# EAGLE design complete system Rev A (EAGLE 7.3.0)
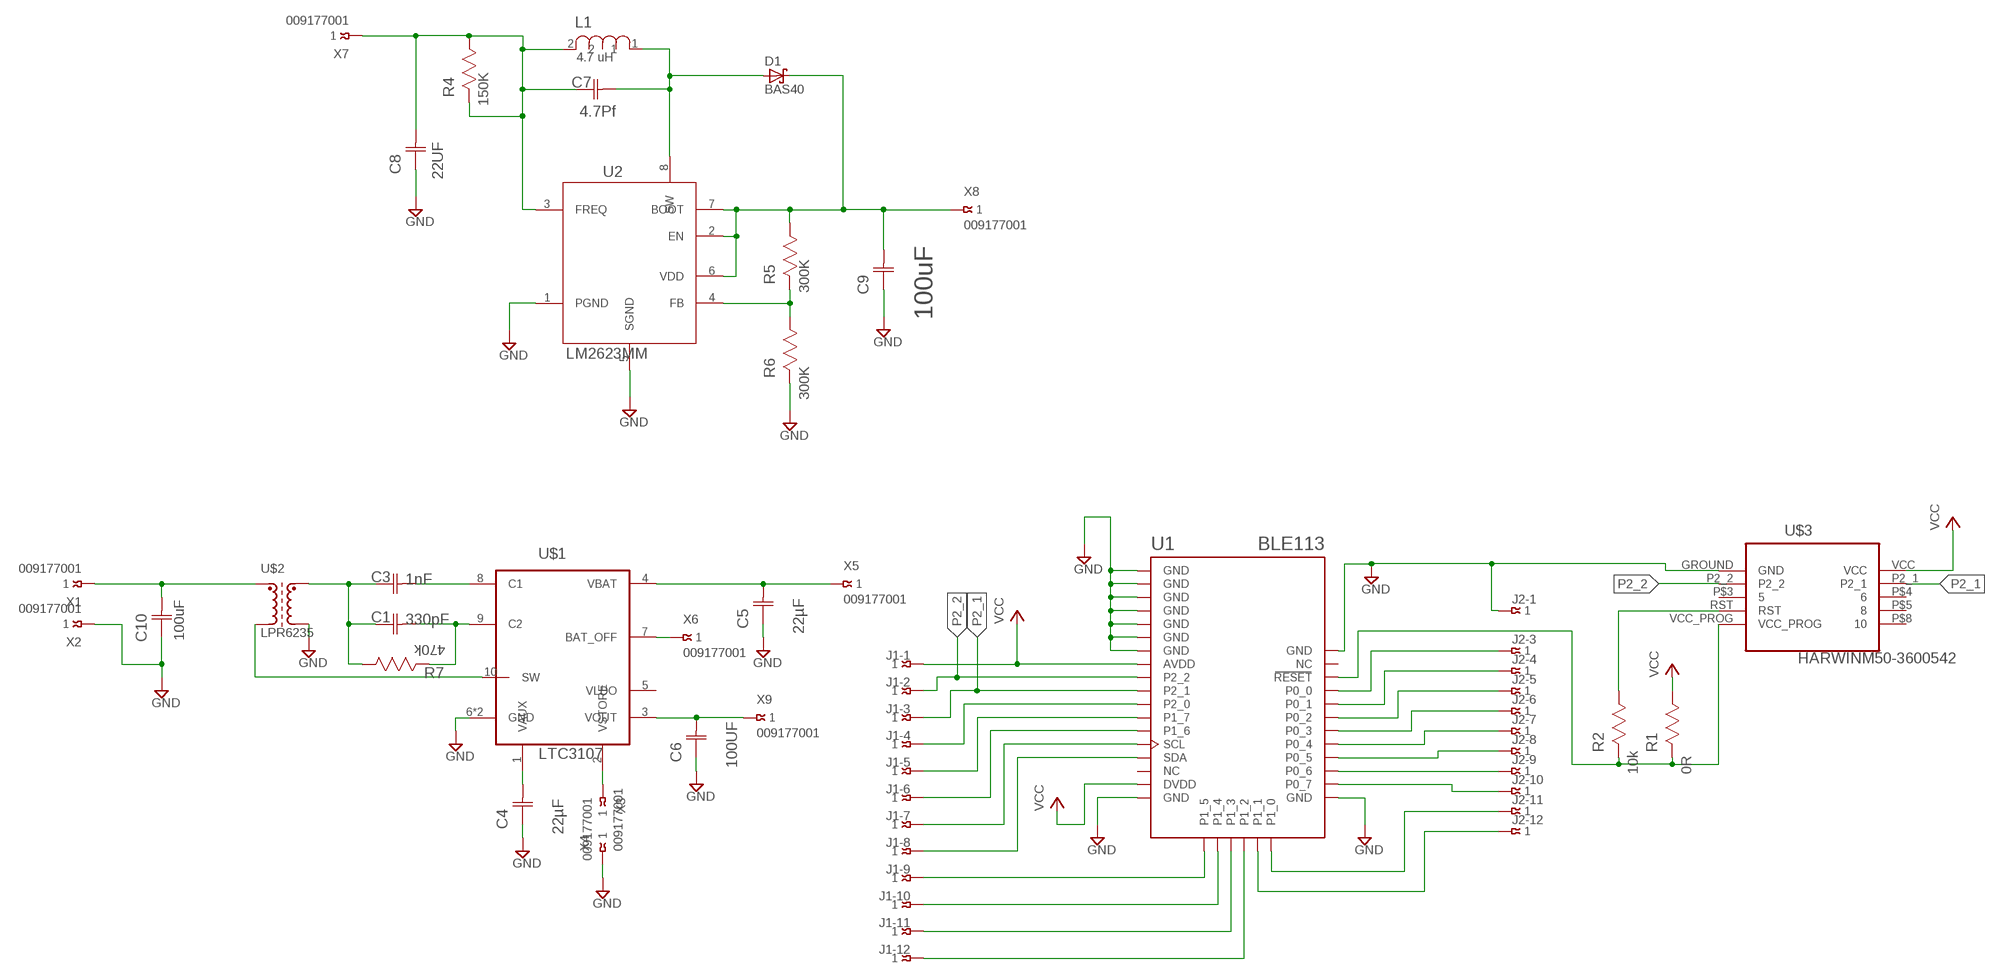
[diagram p0: schematic, sheet 1]

## Parts
C1  330pF  0402YD105KAT2A  [CAPC1005X60N]
C3  1nF  0402YD105KAT2A  [CAPC1005X60N]
C4  22µF  TCJA156M006R0300  [CAPCP3216X180N]
C5  22µF  TCJA156M006R0300  [CAPCP3216X180N]
C6  100UF  TACA107M006XTA  [CAPCP3216X180N]
C7  4.7Pf  0402YD105KAT2A  [CAPC1005X60N]
C8  22UF  0805YA120KAT2A  [CAPC2012X94N]
C9  100uF  C1206C107M9PACTU  [CAPC3216X180N]
C10  100uF  C1206C107M9PACTU  [CAPC3216X180N]
D1  BAS40  [SOT23]
J1-1  009177001  [009177001]
J1-2  009177001  [009177001]
J1-3  009177001  [009177001]
J1-4  009177001  [009177001]
J1-5  009177001  [009177001]
J1-6  009177001  [009177001]
J1-7  009177001  [009177001]
J1-8  009177001  [009177001]
J1-9  009177001  [009177001]
J1-10  009177001  [009177001]
J1-11  009177001  [009177001]
J1-12  009177001  [009177001]
J2-1  009177001  [009177001]
J2-3  009177001  [009177001]
J2-4  009177001  [009177001]
J2-5  009177001  [009177001]
J2-6  009177001  [009177001]
J2-7  009177001  [009177001]
J2-8  009177001  [009177001]
J2-9  009177001  [009177001]
J2-10  009177001  [009177001]
J2-11  009177001  [009177001]
J2-12  009177001  [009177001]
L1  4.7 uH  PM1210-4R7J-RC  [INDC3225X22N]
R1  0R  CRCW0402300KFKED  [RESC1005X40N]
R2  10k  CRCW0402300KFKED  [RESC1005X40N]
R4  150K  CRCW0402150KFKED  [RESC1005X40N]
R5  300K  CRCW0402300KFKED  [RESC1005X40N]
R6  300K  CRCW0402300KFKED  [RESC1005X40N]
R7  470k  CRCW0402300KFKED  [RESC1005X40N]
U1  BLE113  BLE113-VISUAL-A  [BLE113-A]
U2  LM2623MM  [SOP65P490X110-8N]
U$1  LTC3107  [LTC3107]
U$2  LPR6235  [LPR6235]
U$3  HARWINM50-3600542  [HARWINM50-3600542]
X1  009177001  [009177001]
X2  009177001  [009177001]
X3  009177001  [009177001]
X4  009177001  [009177001]
X5  009177001  [009177001]
X6  009177001  [009177001]
X7  009177001  [009177001]
X8  009177001  [009177001]
X9  009177001  [009177001]

## Nets
GND: C4.1(C1) C5.1(C1) C6.1(C1) C8.1(C1) C9.1(C1) C10.1(C1) J2-1.1 R6.2 U1.GND U1.GND@2(GND) U1.GND@3(GND) U1.GND@4(GND) U1.GND@5(GND) U1.GND@6(GND) U1.GND@7(GND) U1.GND@8(GND) U1.GND@9(GND) U1.GND@10(GND) U2.1(PGND) U2.5(SGND) U$1.6(GND) U$1.11(GND) U$2.P$3(OP2) U$3.GROUND(GND) X2.1 X4.1
LL: J2-11.1 U1.P1_0
N$1: C10.2(C2) U$2.P$1(IP1) X1.1
N$2: U$1.10(SW) U$2.P$2(IP2)
N$3: C1.1(C2) R7.2 U$1.9(C2)
N$4: C1.2(C1) C3.2(C1) R7.1 U$2.P$4(OP1)
N$5: C3.1(C2) U$1.8(C1)
N$6: C4.2(C2) U$1.1(VAUX)
N$7: U$1.2(VSTORE) X3.1
N$8: C5.2(C2) U$1.4(VBAT) X5.1
N$9: U$1.7(BAT_OFF) X6.1
N$10: C6.2(C2) U$1.3(VOUT) X9.1
N$12: R2.1 U$3.RST
N$13: J1-4.1 U1.P2_0
N$14: J1-5.1 U1.P1_7
N$15: J1-6.1 U1.P1_6
N$16: J1-7.1 U1.SCL
N$17: J1-8.1 U1.SDA
N$18: J1-9.1 U1.P1_5
N$19: J1-10.1 U1.P1_4
N$20: J1-11.1 U1.P1_3
N$21: J1-12.1 U1.P1_2
N$22: J2-3.1 U1.P0_0
N$23: J2-4.1 U1.P0_1
N$24: R1.2 R2.2 U1.RESET U$3.VCC_PROG
N$25: J2-5.1 U1.P0_2
N$26: J2-6.1 U1.P0_3
N$27: J2-7.1 U1.P0_4
N$28: J2-8.1 U1.P0_5
N$29: J2-9.1 U1.P0_6
N$30: J2-10.1 U1.P0_7
N$31: C7.1(C2) D1.1(A) L1.1 U2.8(SW)
N$32: J2-12.1 U1.P1_1
N$33: C7.2(C1) C8.2(C2) L1.2 R4.1 R4.2 U2.3(FREQ) X7.1
N$35: C9.2(C2) D1.3(C) R5.1 U2.2(EN) U2.6(VDD) U2.7(BOOT) X8.1
N$36: R5.2 R6.1 U2.4(FB)
P2_1: J1-3.1 U1.P2_1 U$3.P2_1
P2_2: J1-2.1 U1.P2_2 U$3.P2_2
VCC: J1-1.1 R1.1 U1.AVDD U1.DVDD U$3.VCC
Unconnected: U1.NC U1.NC@2(NC) U$1.5(VLDO) U$3.P$3 U$3.P$4 U$3.P$5 U$3.P$8

## Library data of the parts
C1 C3 C7 = AVX_By_element14_Batch_1:0402YD105KAT2A: Capacitor 0402; MPN: 0402YD105KAT2A; OC_FARNELL: 1867953; OC_NEWARK: 37T9045; SUPPLIER: AVX; TOLERANCE: ±10%; VALUE: 1uF; VOLTAGERATING: 16V
C4 C5 = AVX_By_element14_Batch_1:TCJA156M006R0300: Tantalum Capacitor , 1206; CAPACITANCETOLERANCE: ±20%; MPN: TCJA156M006R0300; OC_FARNELL: 1546774; OC_NEWARK: 59M9561; SUPPLIER: AVX; VALUE: 15µF; VOLTAGERATING: 6.3V
C6 = AVX_By_element14_Batch_1:TACA107M006XTA: Tantalum Capacitor , 1206; CAPACITANCETOLERANCE: ±20%; MPN: TACA107M006XTA; OC_FARNELL: -; OC_NEWARK: 10R5817; SUPPLIER: AVX; VOLTAGERATING: 6.3V
C8 = AVX_By_element14_Batch_1:0805YA120KAT2A: Capacitor 0805; MPN: 0805YA120KAT2A; OC_FARNELL: -; OC_NEWARK: 55J5412; SUPPLIER: AVX; TOLERANCE: ±10%; VALUE: 12PF; VOLTAGERATING: 16V
C9 C10 = Kemet_By_element14_Batch_1:C1206C107M9PACTU: CAPACITOR, 1206; MPN: C1206C107M9PACTU; OC_FARNELL: 1358552; OC_NEWARK: 94M5669; SUPPLIER: Kemet; TOLERANCE: ±20%; VOLTAGERATING: 6.3V
D1 = diode:BAS40: Silicon Schottky Diodes General-purpose diode for high-speed switching
J1-1-J1-12 J2-1 J2-3-J2-12 X1-X9 = con-avx:00917?001: Wire to Board Strip IDC Connector 1 WAY Source: http://www.avx.com/docs/Catalogs/9177.pdf; MPN: 009177001001006; OC_FARNELL: unknown; OC_NEWARK: 09P1120
L1 = Bourns_By_element14_Batch_1:PM1210-4R7J-RC: CHIP INDUCTOR, 4.7UH 220MA 5% 50MHZ; MPN: PM1210-4R7J-RC; OC_FARNELL: 1180481; OC_NEWARK: 63K3111; SUPPLIER: BOURNS; TOLERANCE: ±5 %; VALUE: 2.2 uH
R1 R2 R5-R7 = Vishay_By_element14_Batch_1:CRCW0402300KFKED: RESISTOR, 0402; MPN: CRCW0402300KFKED; OC_FARNELL: 1563590; OC_NEWARK: 72M6774; SUPPLIER: VISHAY DALE ELECTRONICS; TOLERANCE: ±1%; VALUE: 300K Ohms; WATTAGE: 0.063 W
R4 = Vishay_By_element14_Batch_1:CRCW0402150KFKED: RESISTOR, 0402; MPN: CRCW0402150KFKED; OC_FARNELL: 1652753; OC_NEWARK: 52K6719; SUPPLIER: Vishay; TOLERANCE: ±1%; VALUE: 150K Ohms; WATTAGE: 0.063W
U1 = bluegiga:BLE113-VISUAL: Bluetooth Low Energy single-mode module - Bluetooth 4.0 (CC2541). BLE113-A variant has an on-module ceramic chip antenna. BLE113-A variant includes keepout/restrict area. Antenna edge of the module should be flush up against the edge of the PCB. See datasheet for variant layout details. The BLE113 is a Bluetooth Smart module targeted for small and low-power sensors and accessories. It integrates all features required for a Bluetooth Smart application, including Bluetooth radio, software stack, and GATT-based profiles. The BLE113 Bluetooth Smart module can also host end-user applications, which means no external micro controller is required in size or price constrained devices. Moreover, it has flexible hardware interfaces to connect to different peripherals and sensors and can be powered directly from a standard 3V coin cell battery or a pair of AAA batteries. In the lowest power sleep mode it merely consumes 500 nA and will wake up within a few hundred microseconds. The BLE113 Bluetooth Smart module conusmer approximately 30% less power and is smaller than the BLE112 Bluetooth Smart Module. http://www.bluegiga.com/en-US/products/bluetooth-4.0-modules/ble113-bluetooth--smart-module https://github.com/jrowberg/sf-oshw Last updated 2014-01-04 by Jeff Rowberg <jeff@rowberg.net>; ANTENNA: On-module ceramic chip antenna
U2 = NSC_By_element14_Batch_1.1:LM2623MM: DC/DC Boost Converter; MPN: LM2623MM; OC_FARNELL: 8207453; OC_NEWARK: 41K3962; PACKAGE: 8-MSOP; SUPPLIER: National Semiconductors
U$1 = Nathan:LTC3107
U$2 = Nathan:LPR6235
U$3 = Nathan:HARWINM50-3600542

## Board
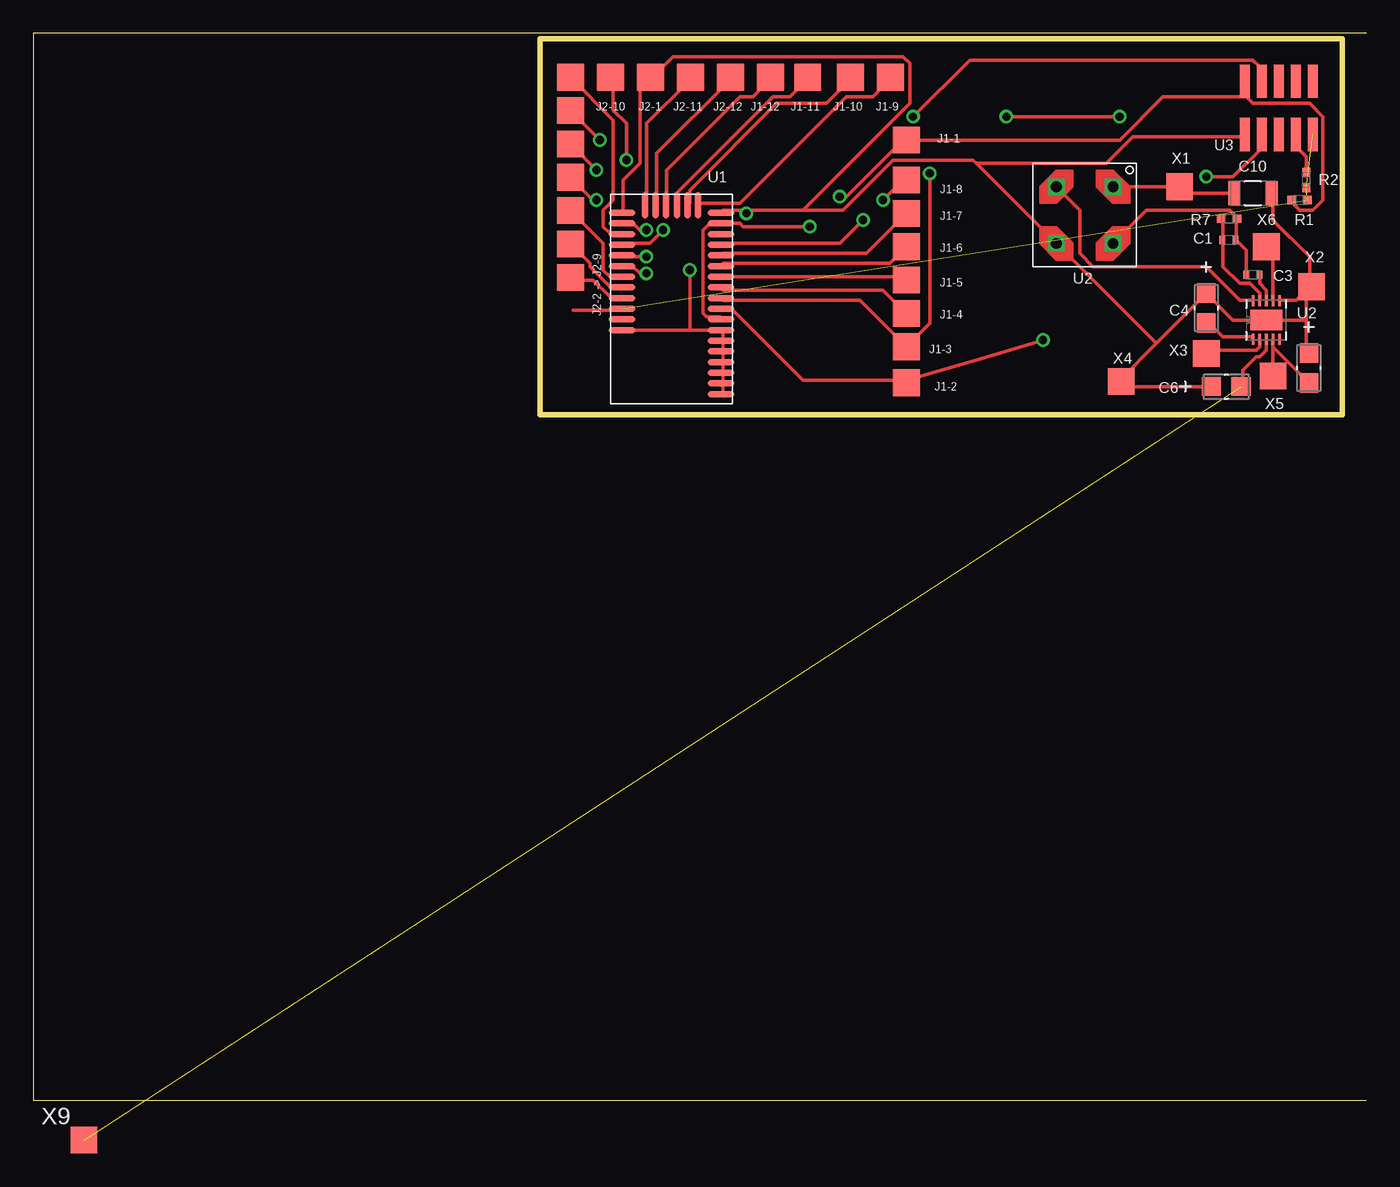
[diagram p1: board, top side]
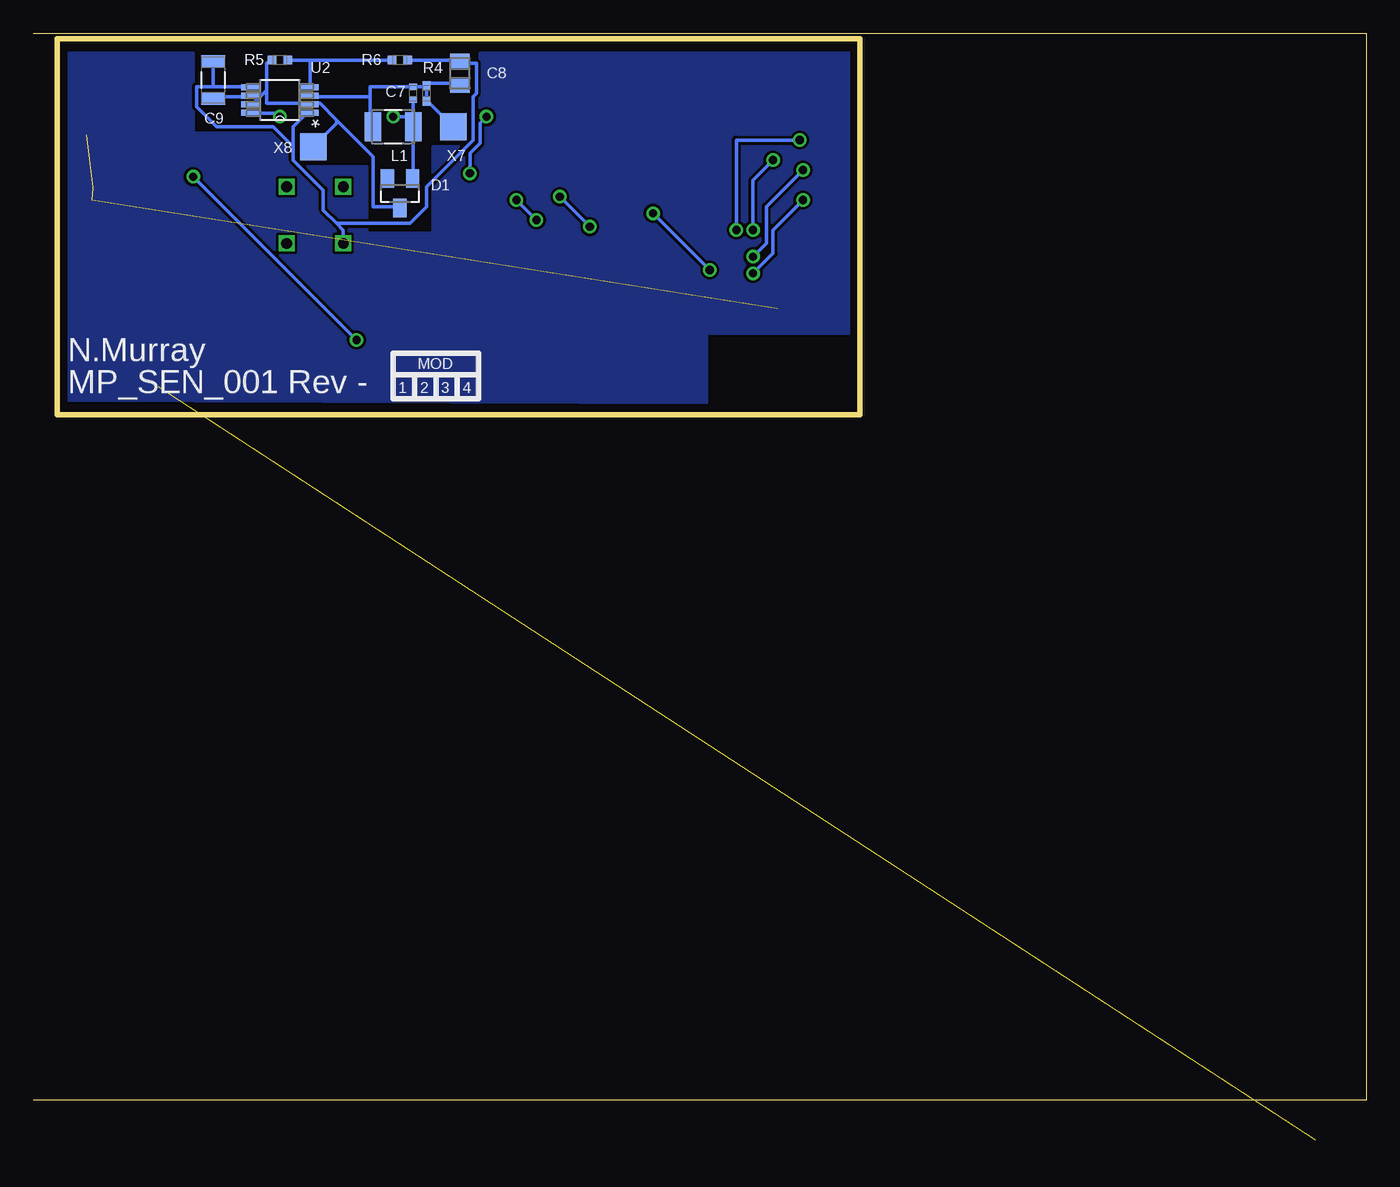
[diagram p2: board, bottom side, seen from below]

Size 100 x 80 mm. Coordinates in mm from the lower left corner, seen from the top.
Outline: 100,0 0,0 0,80 100,80
Outline: 38,51.4 38,79.6 98.2,79.6 98.2,51.4 38,51.4
Copper layers (1*16): Top 0.035mm / dielectric 1.5mm / Bottom 0.035mm
Design rules "olimex 8mil": minimum track width 8mil, minimum drill 0.6mm, track to track 8mil, track to pad 8mil, pad to pad 8mil, via to via 8mil, smd to smd 0mil, copper to edge 20mil, drill to drill 10mil, minimum pad ring 8mil, minimum via ring 8mil, stop-mask expansion 0mil, vias tented up to drill 0mil, thermal gap 10mil

### Footprints (pad centres in the part's own frame; a part is rotated, then mirrored left to right if it is on the bottom)
CAPC1005X60N = smd 0.457 x 0.61: 1 -0.483,0; 2 0.483,0
CAPCP3216X180N = smd 1.448 x 1.397: 1 -1.118,0; 2 1.118,0
CAPC2012X94N = smd 1.118 x 1.448: 1 -0.914,0; 2 0.914,0
CAPC3216X180N = smd 0.914 x 1.803: 1 -1.397,0; 2 1.397,0
SOT23 = smd 1 x 1.4: 1 -0.95,-1.1; 2 0.95,-1.1; 3 0,1.1
009177001 = smd 2 x 2: 1 0,0
INDC3225X22N = smd 1.245 x 2.159: 1 -1.524,0; 2 1.524,0
RESC1005X40N = smd 0.66 x 0.61: 1 -0.584,0; 2 0.584,0
BLE113-A = smd 2 x 0.5: AVDD -3.725,1.538; DVDD -3.725,-5.662; GND -3.725,7.138; GND@2 -3.725,6.338; GND@3 -3.725,5.537; GND@4 -3.725,4.737; GND@5 -3.725,3.938; GND@6 -3.725,3.138; GND@7 -3.725,2.337; GND@8 -3.725,-6.463; GND@9 3.725,-6.463; GND@10 3.725,2.337; NC -3.725,-4.862; NC@2 3.725,1.538; P0_0 3.725,-0.062; P0_1 3.725,-0.863; P0_2 3.725,-1.663; P0_3 3.725,-2.462; P0_4 3.725,-3.263; P0_5 3.725,-4.062; P0_6 3.725,-4.862; P0_7 3.725,-5.662; P1_6 -3.725,-2.462; P1_7 -3.725,-1.663; P2_0 -3.725,-0.863; P2_1 -3.725,-0.062; P2_2 -3.725,0.738; RESET 3.725,0.738; SCL -3.725,-3.263; SDA -3.725,-4.062 | smd 0.5 x 2: P1_0 2,-7.013; P1_1 1.2,-7.013; P1_2 0.4,-7.013; P1_3 -0.4,-7.013; P1_4 -1.2,-7.013; P1_5 -2,-7.013
SOP65P490X110-8N = smd 1.372 x 0.457: 1 -2.21,0.965; 2 -2.21,0.33; 3 -2.21,-0.33; 4 -2.21,-0.965; 5 2.21,-0.965; 6 2.21,-0.33; 7 2.21,0.33; 8 2.21,0.965
LTC3107 = smd 0.813 x 0.203: 1 -1.448,0.991; 2 -1.448,0.508; 3 -1.448,0; 4 -1.448,-0.508; 5 -1.448,-0.991; 6 1.448,-0.991; 7 1.448,-0.508; 8 1.448,0; 9 1.448,0.508; 10 1.448,0.991 | smd 1.549 x 2.388: 11 0,0
LPR6235 = drill 0.8 square: P$1 -2,2; P$2 -2,-2.25; P$3 2.25,-2.25; P$4 2.25,2
HARWINM50-3600542 = smd 0.75 x 2.5: GROUND 0,-4; P2_1 1.27,0; P2_2 1.27,-4; P$3 2.54,0; P$4 3.81,0; P$5 5.08,0; P$8 2.54,-4; RST 3.81,-4; VCC 0,0; VCC_PROG 5.08,-4

### Placement (x,y rotation side)
C1  89.7,64.5 0 top
C3  91.5,61.9 180 top
C4  88,59.4 270 top
C5  95.7,54.9 270 top
C6  89.5,53.5 0 top
C7  71.5,75.5 90 bottom
C8  68,77 270 bottom
C9  86.5,76.5 270 bottom
C10  91.5,68 180 top
D1  72.5,68 180 bottom
J1-1  65.5,72 90 top
J1-2  65.5,53.8 0 top
J1-3  65.5,56.5 0 top
J1-4  65.5,59 0 top
J1-5  65.5,61.5 0 top
J1-6  65.5,64 0 top
J1-7  65.5,66.5 0 top
J1-8  65.5,69 0 top
J1-9  64.3,76.7 0 top
J1-10  61.3,76.7 0 top
J1-11  58.1,76.7 0 top
J1-12  55.3,76.7 0 top
J2-1  46.3,76.7 90 top
J2-3  40.3,61.7 0 top
J2-4  40.3,64.2 0 top
J2-5  40.3,66.7 0 top
J2-6  40.3,69.2 0 top
J2-7  40.3,71.7 0 top
J2-8  40.3,74.2 0 top
J2-9  40.3,76.7 0 top
J2-10  43.3,76.7 0 top
J2-11  49.3,76.7 0 top
J2-12  52.3,76.7 0 top
L1  73,73 180 bottom
R1  95,67.5 0 top
R2  95.5,69 270 top
R4  70.5,75.5 270 bottom
R5  81.5,78 0 bottom
R6  72.5,78 0 bottom
R7  89.7,66.1 180 top
U1  47.88,60.08 180 top
U2  81.5,75 180 bottom
U$1  92.5,58.5 90 top
U$2  79,66.5 270 top
U$3  90.9,76.4 0 top
X1  86,68.5 0 top
X2  95.9,61 0 top
X3  88,56 0 top
X4  81.6,53.9 0 top
X5  93,54.3 90 top
X6  92.5,64 0 top
X7  68.5,73 0 bottom
X8  79,71.5 0 bottom
X9  3.8,-3 0 top

### Tracks (layer width: path | path; a pad name or v marks a point on that pad's centre or on a via)
GND  (via drill 0.61)
  Top 0.254: 95.75,61 95.5,60.75 | 95.5,60.75 94.75,60 93.5,60 U$1.6 | 95.5,60.75 95.5,58.5 | 95.5,58.5 95.5,56.25 C5.1 | 95.5,60.75 X2.1 95.75,61 | 95.75,61 95.75,63.25 93,66 93,68 C10.1 | 95.5,58.5 U$1.11 90,58.5 88,60.5 | C6.1 82,53.5 X4.1 81.5,54 84.25,56.75 | 84.25,56.75 88,60.5 | U1.GND@9 44.25,66.75 44.25,69 45.5,70.25 45.5,75.75 46.25,76.5 J2-1.1 46.5,76.75 48,78.25 65.25,78.25 65.75,77.75 65.75,74.75 57.75,66.75 | U1.GND 51.75,53 51.75,53.5 U1.GND@2 51.75,53.75 51.75,54.5 U1.GND@3 51.75,54.75 51.75,55.25 U1.GND@4 51.75,55.5 51.75,56 U1.GND@5 51.75,56.25 51.75,56.75 U1.GND@6 51.75,57 51.75,57.5 U1.GND@7 51.5,57.75 49.25,57.75 | 49.25,57.75 44.25,57.75 U1.GND@10 | 57.75,66.75 60.75,66.75 64.5,70.5 70.5,70.5 70.75,70.25 | 57.75,66.75 53.5,66.75 | 53.5,66.75 51.75,66.75 U1.GND@8 | 70.75,70.25 U$2.P$3 84.25,56.75 | 70.75,70.25 80.5,70.25 82.5,72.25 90.75,72.25 U$3.GROUND | v49.25,62.25 49.25,57.75 | 53.5,66.75 v53.5,66.5 | 88,60.5 C4.1
  Bottom 0.254: 86.5,76 83.75,76 U2.5 | C9.1 86.5,76 | R6.2 68,78 C8.1 68,77.75 66.75,77.75 66.75,75.5 67,75.25 67,72 70.5,68.5 70.5,67 71.75,65.75 77.25,65.75 | 80.5,71.5 80.5,70.5 78.25,68.25 78.25,66.75 77.25,65.75 | 80.5,71.5 80.5,73 79.5,74 U2.1 | 77.25,65.75 76.75,65.25 U$2.P$3 | 86.5,76 87.75,76 87.75,74.5 86.25,73 82,73 80.5,71.5 | v53.5,66.5 v49.25,62.25
LL
  Top 0.254: U1.P1_0 46,67.25 46,73.25 49.25,76.5 J2-11.1
N$1
  Top 0.254: C10.2 86.5,68 X1.1 U$2.P$1
N$2
  Top 0.254: U$2.P$2 78.5,66.75 78.5,63.5 79.5,62.5 88,62.5 90.5,60 91.5,60 U$1.10
N$3
  Top 0.254: 89.25,64.5 89.25,66 R7.2 | 89.25,64.5 89.25,62.5 90.5,61.25 91.25,61.25 92,60.5 92,60 U$1.9 | 89.25,64.5 C1.1
N$4
  Top 0.254: 90.25,64.5 91,63.75 91,62 C3.2 | 90.25,64.5 90.25,66 R7.1 90.25,66.25 89.75,66.75 83.5,66.75 U$2.P$4 | 90.25,64.5 C1.2
N$5
  Top 0.254: U$1.8 92.5,60.75 92,61.25 92,61.75 C3.1
N$6
  Top 0.254: U$1.1 91.5,57.25 89.25,57.25 88,58.5 C4.2
N$7
  Top 0.254: X3.1 88.25,56.25 91.75,56.25 92,56.5 92,57 U$1.2
N$8
  Top 0.254: X5.1 93,56.5 | 93,56.5 93,57 U$1.4 | 93,56.5 95.5,54 C5.2
N$9
  Top 0.254: X6.1 93,63.5 93,60 U$1.7
N$10  (1 unrouted)
  Top 0.254: U$1.3 92.5,56.25 92,55.75 91.75,55.75 90.75,54.75 90.75,53.5 C6.2
N$12
  Top 0.254: R2.1 95.5,70.75 94.75,71.5 94.75,72.25 U$3.RST
N$13
  Top 0.254: J1-4.1 63.75,60.75 51.75,60.75 U1.P2_0
N$14
  Top 0.254: J1-5.1 65.25,61.75 51.75,61.75 U1.P1_7
N$15
  Top 0.254: J1-6.1 64.25,62.75 51.75,62.75 U1.P1_6
N$16
  Top 0.254: J1-7.1 62.5,63.5 51.75,63.5 U1.SCL
N$17  (via drill 0.61)
  Top 0.254: v62.25,66 60.5,64.25 51.75,64.25 U1.SDA | v63.75,67.5 65.25,69 J1-8.1
  Bottom 0.254: v63.75,67.5 v62.25,66
N$18
  Top 0.254: U1.P1_5 50,67.25 53,67.25 61,75.25 63,75.25 64.25,76.5 J1-9.1
N$19
  Top 0.254: U1.P1_4 49.25,67.25 49.25,68.25 55.75,74.75 59.5,74.75 61.25,76.5 J1-10.1
N$20
  Top 0.254: U1.P1_3 48.25,67.25 48.25,68 55.5,75.25 56.75,75.25 58,76.5 J1-11.1
N$21
  Top 0.254: U1.P1_2 47.5,67.25 47.5,69.75 53,75.25 54,75.25 55.25,76.5 J1-12.1
N$22
  Top 0.254: J2-3.1 40.5,61.5 42,61.5 43.25,60.25 44,60.25 U1.P0_0
N$23
  Top 0.254: J2-4.1 41.75,62.75 41.75,62.5 43.25,61 44,61 U1.P0_1
N$24  (3 unrouted)
  Top 0.254: 40.5,59.25 44,59.25 U1.RESET
N$25
  Top 0.254: J2-5.1 42.75,64.25 42.75,62.25 43.25,61.75 44,61.75 U1.P0_2
N$26  (via drill 0.61)
  Top 0.254: J2-6.1 42,67.5 v42.25,67.5 | v46,62 45.5,62 45,62.5 44.25,62.5 U1.P0_3
  Bottom 0.254: v42.25,67.5 44.5,65.25 44.5,63.5 v46,62
N$27  (via drill 0.61)
  Top 0.254: v42.25,69.75 J2-7.1 | v46,63.25 44.25,63.25 U1.P0_4
  Bottom 0.254: v42.25,69.75 45,67 45,64.25 v46,63.25
N$28  (via drill 0.61)
  Top 0.254: v42.5,72 J2-8.1 | v47.25,65.25 46.25,64.25 44.25,64.25 U1.P0_5
  Bottom 0.254: v42.5,72 47.25,72 v47.25,65.25
N$29
  Top 0.254: J2-9.1 43.5,73.5 43.5,67.5 42.75,66.75 42.75,65.5 43.25,65 44,65 U1.P0_6
N$30  (via drill 0.61)
  Top 0.254: v44.5,70.5 44.5,73.25 43.5,74.25 43.5,76.5 J2-10.1 | v46,65.25 45.5,65.25 45,65.75 44.25,65.75 U1.P0_7
  Bottom 0.254: v44.5,70.5 46,69 v46,65.25
N$31  (via drill 0.61)
  Top 0.254: v73,73.75 v81.5,73.75
  Bottom 0.254: 71.5,73 71.5,73.75 | 71.5,73.75 C7.1 | v81.5,73.75 81.5,74 83.5,74 U2.8 | 71.5,73.75 v73,73.75 | 71.5,73.75 L1.1 71.5,73 | 71.5,73 71.5,69.25 D1.1
N$32
  Top 0.254: U1.P1_1 46.75,67.25 46.75,71 52.25,76.5 J2-12.1
N$33
  Bottom 0.254: 70.5,76 71.5,76 | 70.5,76 70.5,75 | 70.5,76 R4.1 70.5,76.25 68,76.25 C8.2 | 70.5,75 X7.1 | 70.5,75 R4.2 | 74.75,75.25 79.25,75.25 U2.3 | 74.75,75.25 74.75,73 L1.2 | 71.5,76 74.75,76 74.75,75.25 | 71.5,76 C7.2
N$34
  pour Bottom: 38.7,78.5 38.5,57.5 49.5,57.5 49.5,52.3 97.5,52.5 97.5,78.5 88,78.5 88,72.5 80.5,72.5 80.5,70 75,70 75,65 70,65 70,71.5 66.5,71.5 66.5,78.5
N$35
  Bottom 0.254: 82.5,75.75 82.5,77.75 82.25,78 R5.1 | 83.25,75 83.5,74.75 U2.7 | 83.25,75 82.5,75.75 | 82.5,75.75 82.5,74.75 79.5,74.75 U2.2 79.25,74.75 78.5,74.75 77.25,73.5 | 83.25,75 83.5,75.25 U2.6 83.75,75.25 86.5,75.25 C9.2 | 77.25,73.5 74.5,70.75 74.5,67 72.5,67 D1.3 | X8.1 77.25,73.25 77.25,73.5
N$36
  Bottom 0.2: 79.25,76 U2.4
  Bottom 0.254: R5.2 79.25,78 | 79.25,78 R6.1 | 79.25,78 79.25,76
P2_1  (via drill 0.61)
  Top 0.254: U1.P2_1 51.75,60 62,60 J1-3.1 67.25,58.25 v67.25,69.5 | v66,73.75 70.25,78 91.5,78 92,77.5 92,76.5 U$3.P2_1
  Bottom 0.254: v66,73.75 66.5,73.25 66.5,71.75 67.25,71 v67.25,69.5
P2_2  (via drill 0.61)
  Top 0.254: 65.5,54 57.75,54 52.5,59.25 51.75,59.25 U1.P2_2 | v88,69.25 90,69.25 92,71.25 92,72.25 U$3.P2_2 | v75.75,57 71.1,55.6 65.5,54 | 65.5,54 J1-2.1
  Bottom 0.254: v75.75,57 v88,69.25
VCC  (via drill 0.61)
  Top 0.254: U1.AVDD 51.5,58.75 50.5,58.75 50.25,59 50.25,65.25 50.75,65.75 51.5,65.75 U1.DVDD 51.75,65.75 53,65.75 53.25,65.5 v58.25,65.5 | 91,75.25 91.5,74.75 95.75,74.75 96.75,73.75 96.75,67.5 96,66.75 95,66.75 94.5,67.25 94.5,67.5 R1.1 | 91,75.25 91,76.25 U$3.VCC 91,75.25 | 91,75.25 84.75,75.25 81.5,72 J1-1.1 65.25,72 61,67.75 v60.5,67.75
  Bottom 0.254: v60.5,67.75 v58.25,65.5

### Text on the board
tPlace: J2-10 | J2-1 | J2-11 | J2-12 | J1-12 | J1-11 | J1-10 | J1-9 | J1-1 | U3 | X1 | C10 | U1 | R2 | J1-8 | J1-7 | R7 | X6 | R1 | J1-6 | C1 | X2 | J1-5 | U2 | C3 | J2-2 -> J2-9 | J1-4 | C4 | U2 | J1-3 | X3 | X4 | J1-2 | C6 | X5
bPlace: R6 | R5 | C8 | R4 | U2 | C7 | C9 | X8 | X7 | L1 | D1 | MOD | N.Murray | 4 | 3 | 2 | 1 | MP_SEN_001 Rev -